# EasyEDA Pro project ProPrj_SRC_Robot2025_V1.0_2026-09-06.epro, schematic Schematic-ENCODER_1
Board Name: Encoder_1; Create Date: 2026-02-11; Page Name: P1; Project Name: SRC_Robot2025_V1.0; Schematic Name: Schematic-ENCODER_1; Update Date: 2026-02-11; Company: 嘉立创EDA; Page Size: A4; Version: V1.0
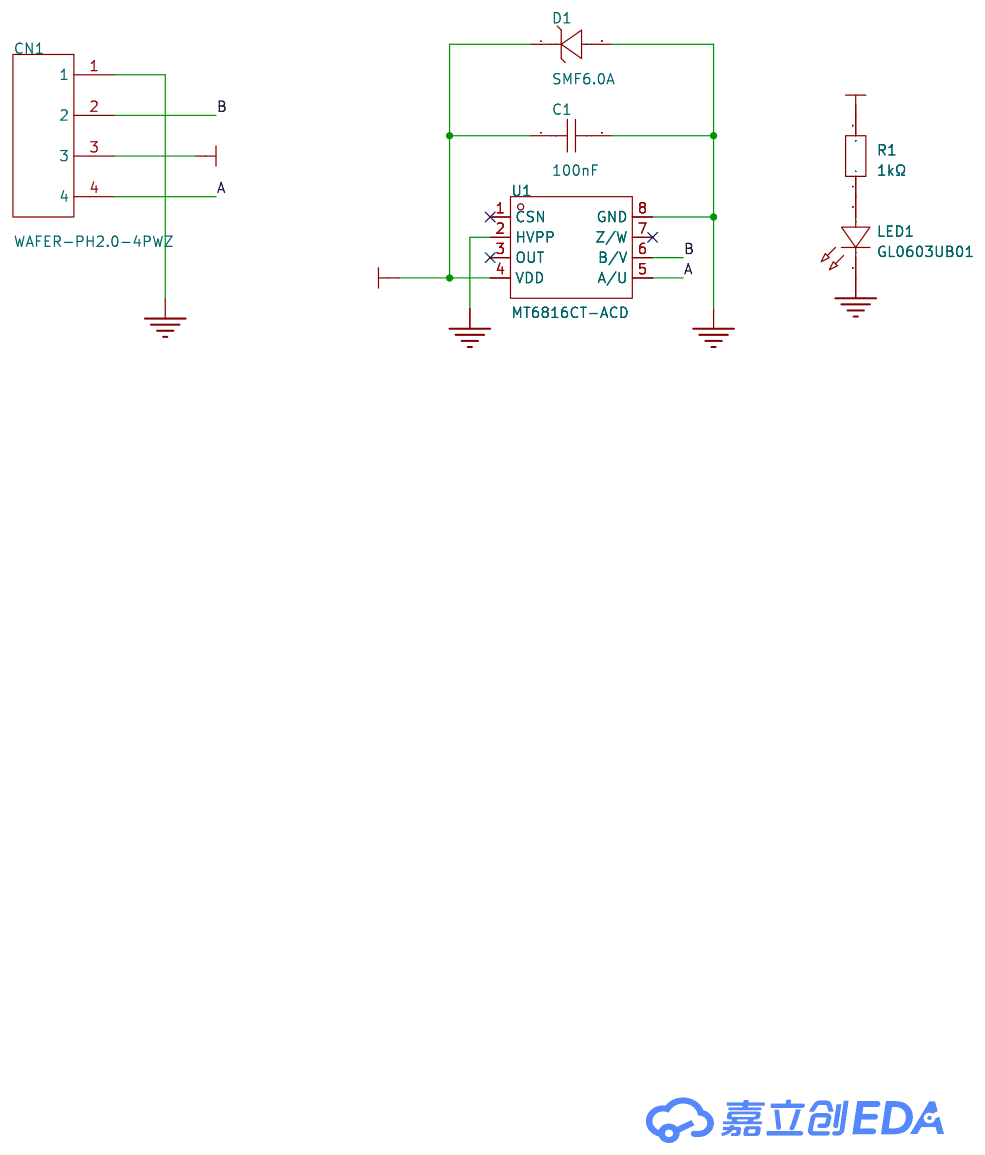
[diagram p4: schematic sheet]

## Parts
C1  100nF  [C0603]
CN1  WAFER-PH2.0-4PWZ  [CONN-TH_4P-P2.00_BX-PH2.0-4PWZ]
D1  SMF6.0A  [SOD-123FL_L2.7-W1.8-LS3.8-RD]
LED1  GL0603UB01  [LED0603-RD_BLUE]
R1  1kΩ  [R0603]
U1  MT6816CT-ACD  [SOP-8_L5.0-W4.0-P1.27-LS6.0-BL]

## Library data of the parts
C1 = CGA0603X7R104K500JT: 容值:100nF;精度:±10%;额定电压:50V;材质(温度系数):X7R;; LCSC Part Name: 100nF ±10% 50V; Supplier Part: C6119867; Manufacturer: HRE(芯声); Supplier Footprint: 0603; JLCPCB Part Class: 扩展库; Supplier: LCSC; Tolerance: ±10%; Voltage Rated: 50V; Temperature Coefficient: X7R
CN1 = WAFER-PH2.0-4PWZ: 插针结构:1x4P;间距:2mm;安装方式:弯插;参考系列:PH;总PIN数:4P;排数:1;每排PIN数:4;行距:-;额定电流:2A;触头材质:黄铜;触头镀层:锡;工作温度:-25℃~+85℃;; LCSC Part Name: 1x4P 间距:2mm 弯插 系列:PH; Supplier Part: C5359612; Manufacturer: XUNPU(讯普); Supplier Footprint: 弯插,P=2mm; JLCPCB Part Class: Extended Part; Datasheet: https://atta.szlcsc.com/upload/public/pdf/source/20230728/47B07572F36CD4F6F91BE29B817CECA3.pdf; Supplier: LCSC; Pins Structure: 1x4P; Pitch: 2mm; Mounting Type: 弯插; Reference Series: PH; Number of Pins: 4P; Number of Rows: 1; Number of PINs Per Row: 4; Current Rating: 2A; Contact Material: 黄铜; Contact Plating: 锡; Operating Temperature: -25℃~+85℃; Voltage Rating: 250V; Plastic Material: PA66; Flame Retardant Rating: UL94V-0; Color: 白色; Z-Height of the Board: 4.7mm; X-Length of Bottom Edge on Board (Spacing Line): 10mm; Y-Width of Bottom Edge on Board: 6.05mm
D1 = SMF6.0A_C19077499: 极性:单向;反向截止电压(Vrwm):6V;钳位电压:10.3V;峰值脉冲电流(Ipp):19.4A@10/1000us;峰值脉冲功率(Ppp):200W@10/1000us;击穿电压:7.37V;; LCSC Part Name: 单向TVS 6V截止 峰值浪涌电流：19.4A@10/1000us; Supplier Part: C19077499; Manufacturer: R+O(宏嘉诚); Supplier Footprint: SOD-123FL; JLCPCB Part Class: 扩展库; Datasheet: https://item.szlcsc.com/datasheet/SMF6.0A/20275584.html; Supplier: LCSC; Polarity: 单向; Reverse Stand-Off Voltage (Vrwm): 6V; Clamping Voltage: 10.3V; Peak Pulse Current (Ipp): 19.4A@10/1000us; Peak Pulse Power Dissipation (Ppp): 200W@10/1000us; Voltage - Breakdown: 7.37V; Reverse Leakage Current (Ir): 400uA; Number of Channels: 单路; Operating Temperature: -55℃~+150℃; level of protection: IEC 61000-4-2; Type: TVS
LED1 = GL0603UB01: 发光颜色:蓝色;正向压降(Vf):2.9V;正向电流:20mA;波长:460nm~469nm;二极管配置:独立二极管;透镜颜色:无色透明透镜;发光强度:72mcd;发光角度:120°;载带方式:正贴;工作温度:-40℃~+85℃;; LCSC Part Name: 0603 蓝灯 高亮; Supplier Part: C51933294; Manufacturer: Guiguang light(桂光光电); Supplier Footprint: 0603; JLCPCB Part Class: 扩展库; Datasheet: https://item.szlcsc.com/datasheet/GL0603UB01/54645990.html; Supplier: LCSC; Illumination Color: 蓝色; Voltage - Forward(Vf): 2.9V; Forward Current: 20mA; Wavelength - Dominant: 460nm~469nm; Diode Configuration: 独立二极管; Lens Color: 无色透明透镜; Luminous Intensity: 72mcd; Viewing Angle: 120°; Mounting Style: 正贴; Operating Temperature: -40℃~+85℃
R1 = FRC0603F1001TS: 电阻类型:厚膜电阻;阻值:1kΩ;精度:±1%;功率:100mW;工作电压:75V;温度系数:±100ppm/℃;; LCSC Part Name: 1kΩ ±1% 100mW 厚膜电阻; Supplier Part: C2907002; Manufacturer: FOJAN(富捷); Supplier Footprint: 0603; JLCPCB Part Class: 扩展库; Supplier: LCSC; Type: 厚膜电阻; Tolerance: ±1%; Power(Watts): 100mW; Voltage-Supply(Max): 75V; Temperature Coefficient: ±100ppm/℃; Operating Temperature: -55℃~+155℃
U1 = MT6816CT-ACD: AB=1024线，Z=4LSB，PWM=1KHz; LCSC Part Name: 零延迟磁角位置传感器IC; Supplier Part: C879560; Manufacturer: MagnTek(麦歌恩); Supplier Footprint: SOP-8; JLCPCB Part Class: 扩展库; Datasheet: https://item.szlcsc.com/datasheet/MT6816CT-ACD/940264.html; Supplier: LCSC

## Nets
+5V: C1.1 CN1.3 D1.1(K) R1.2 U1.4(VDD)
GND: C1.2 CN1.1 D1.2(A) LED1.1(K) U1.2(HVPP) U1.8(GND)
A: CN1.4 U1.5(A/U)
B: CN1.2 U1.6(B/V)
$1N2167: LED1.2(A) R1.1

Not connected (* = marked no-connect by the designer): U1 1(CSN)* 3(OUT)* 7(Z/W)*
